# EasyEDA schematic SCH_CheetahSpeedometer-Matt-Lin_2024-07-12.json
TITLE: Sheet_1; REV: 1.0; Date: 2024-07-12; Sheet: 1/1; Drawn By: mattkachanlin14; Company: Your Company
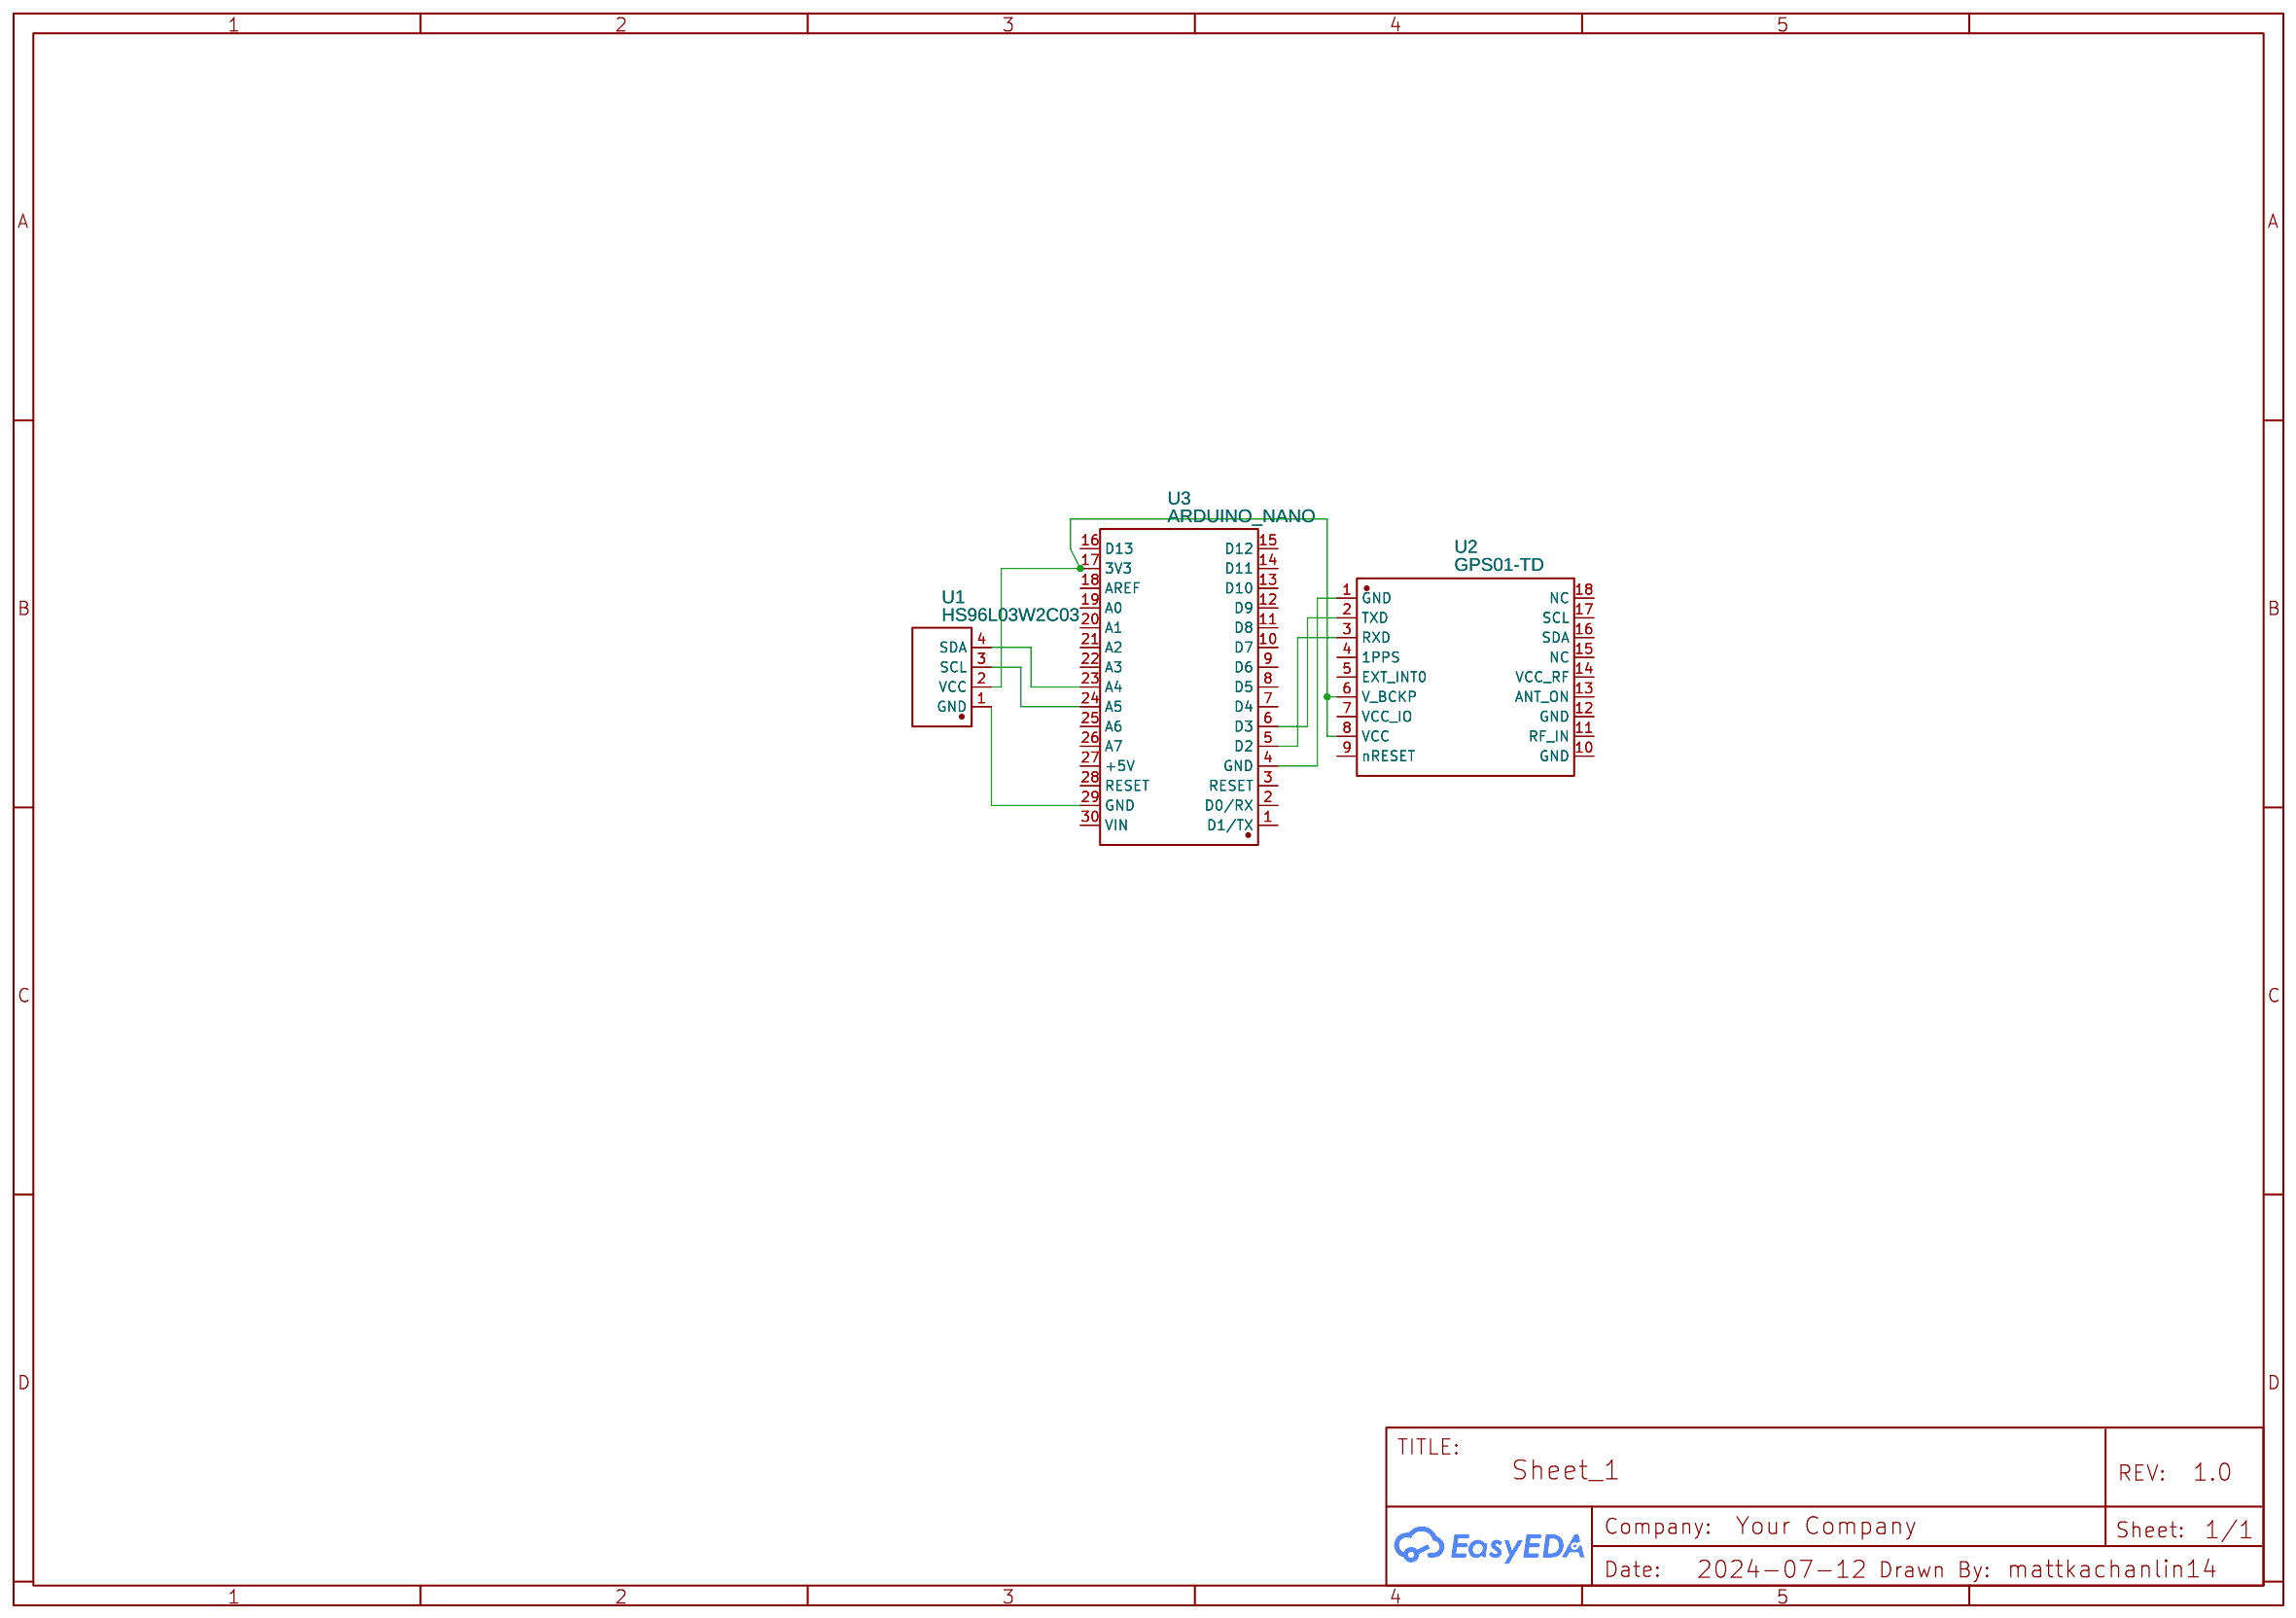
[diagram p0: schematic sheet]

## Parts
U1  HS96L03W2C03  [OLED-TH_L27.8-W27.2-P2.54_C9900033791]
U2  GPS01-TD  [WIRELM-SMD_18P-L10.1-W9.9_P1.10-TL]
U3  ARDUINO_NANO  [COMM-TH_ARDUINO_NANO]

## Library data of the parts
U1 = HS96L03W2C03: Contributor: lcsc; Supplier: LCSC; Supplier Part: C5248080; Manufacturer: HS(汉昇); JLCPCB Part Class: Extended Part
U2 = GPS01-TD: Contributor: lcsc; Supplier: LCSC; Supplier Part: C5356635; Manufacturer: G-NiceRF(思为无线)
U3 = ARDUINO_NANO: Contributor: lcsc; Supplier: LCSC; Supplier Part: C9900017879; Manufacturer: null; JLCPCB Part Class: Extended Part

## Nets
Net-(U1-1): U1.1(GND) U3.29(GND)
Net-(U1-2): U1.2(VCC) U2.6(V_BCKP) U2.8(VCC) U3.17(3V3)
Net-(U1-3): U1.3(SCL) U3.24(A5)
Net-(U1-4): U1.4(SDA) U3.23(A4)
Net-(U2-1): U2.1(GND) U3.4(GND)
Net-(U2-2): U2.2(TXD) U3.6(D3)
Net-(U2-3): U2.3(RXD) U3.5(D2)

Not connected (* = marked no-connect by the designer): U2 4(1PPS) 5(EXT_INT0) 7(VCC_IO) 9(nRESET) 10(GND) 11(RF_IN) 12(GND) 13(ANT_ON) 14(VCC_RF) 15(NC) 16(SDA) 17(SCL) 18(NC); U3 1(D1/TX) 2(D0/RX) 3(RESET) 7(D4) 8(D5) 9(D6) 10(D7) 11(D8) 12(D9) 13(D10) 14(D11) 15(D12) 16(D13) 18(AREF) 19(A0) 20(A1) 21(A2) 22(A3) 25(A6) 26(A7) 27(+5V) 28(RESET) 30(VIN)
